# Altium project IRNAS_MPPT LT3652.PrjPcb
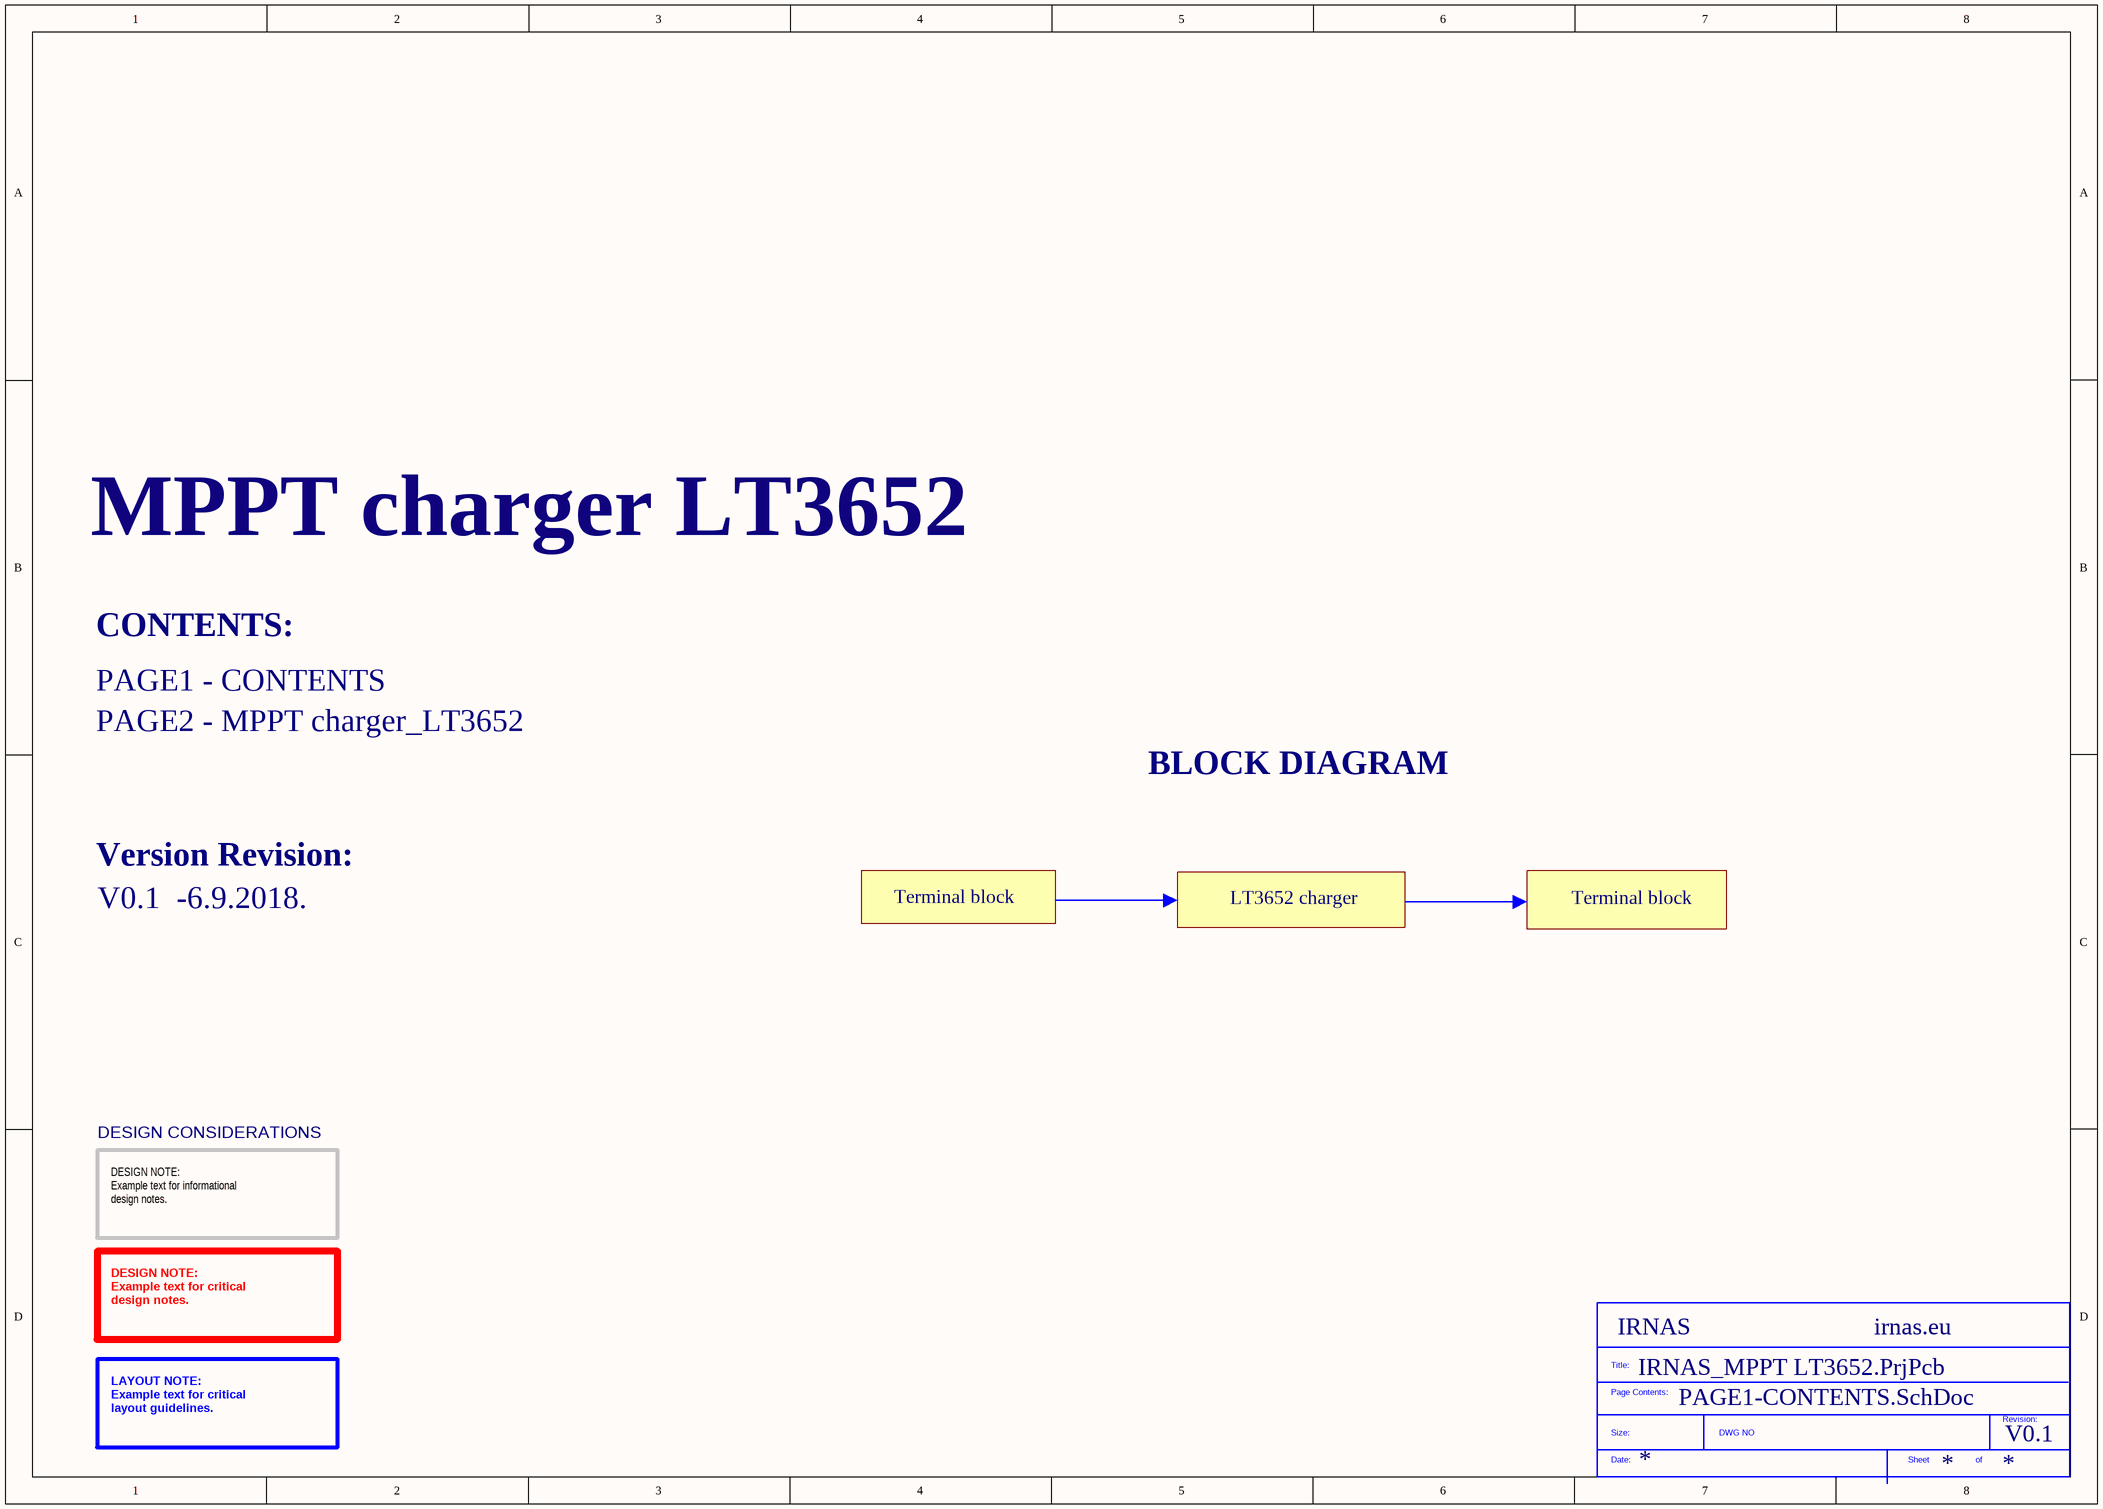
[diagram p0: PAGE1-CONTENTS.SchDoc]
Company: IRNAS; ProjectTitle: MPPT charger LT3652; Version: V0.1; website: irnas.eu
2 sheets, 25 parts. Net scope: global (net labels, ports and power ports of the same name join across sheets).
Board files: MPPT charger.PcbDoc, MPPT charger panel.PcbDoc
Sheets:
  PAGE1-CONTENTS.SchDoc
  PAGE2-MPPT charger_LT3652.SchDoc

## Sheet PAGE1-CONTENTS.SchDoc
size A3

### Parts
(Parts that share a designator on the sheet are numbered #1, #2 ... from top to bottom, then left to right.)
*?#1  SDTitleBlock  (value not drawn)  (graphical)

### Notes on the sheet
- CONTENTS:
- PAGE1 - CONTENTS
- PAGE2 - MPPT charger_LT3652
- BLOCK DIAGRAM
- Version Revision:
- V0.1  -6.9.2018.
- Terminal block
- LT3652 charger
- DESIGN CONSIDERATIONS
- DESIGN NOTE:
  Example text for informational
  design notes.
- DESIGN NOTE:
  Example text for critical
  design notes.
- LAYOUT NOTE:
  Example text for critical
  layout guidelines.
- (in symbol SDTitleBlock) Title:; Page Contents:; Revision:; Size:; DWG NO; Date:; Sheet; of

## Sheet PAGE2-MPPT charger_LT3652.SchDoc
size A3
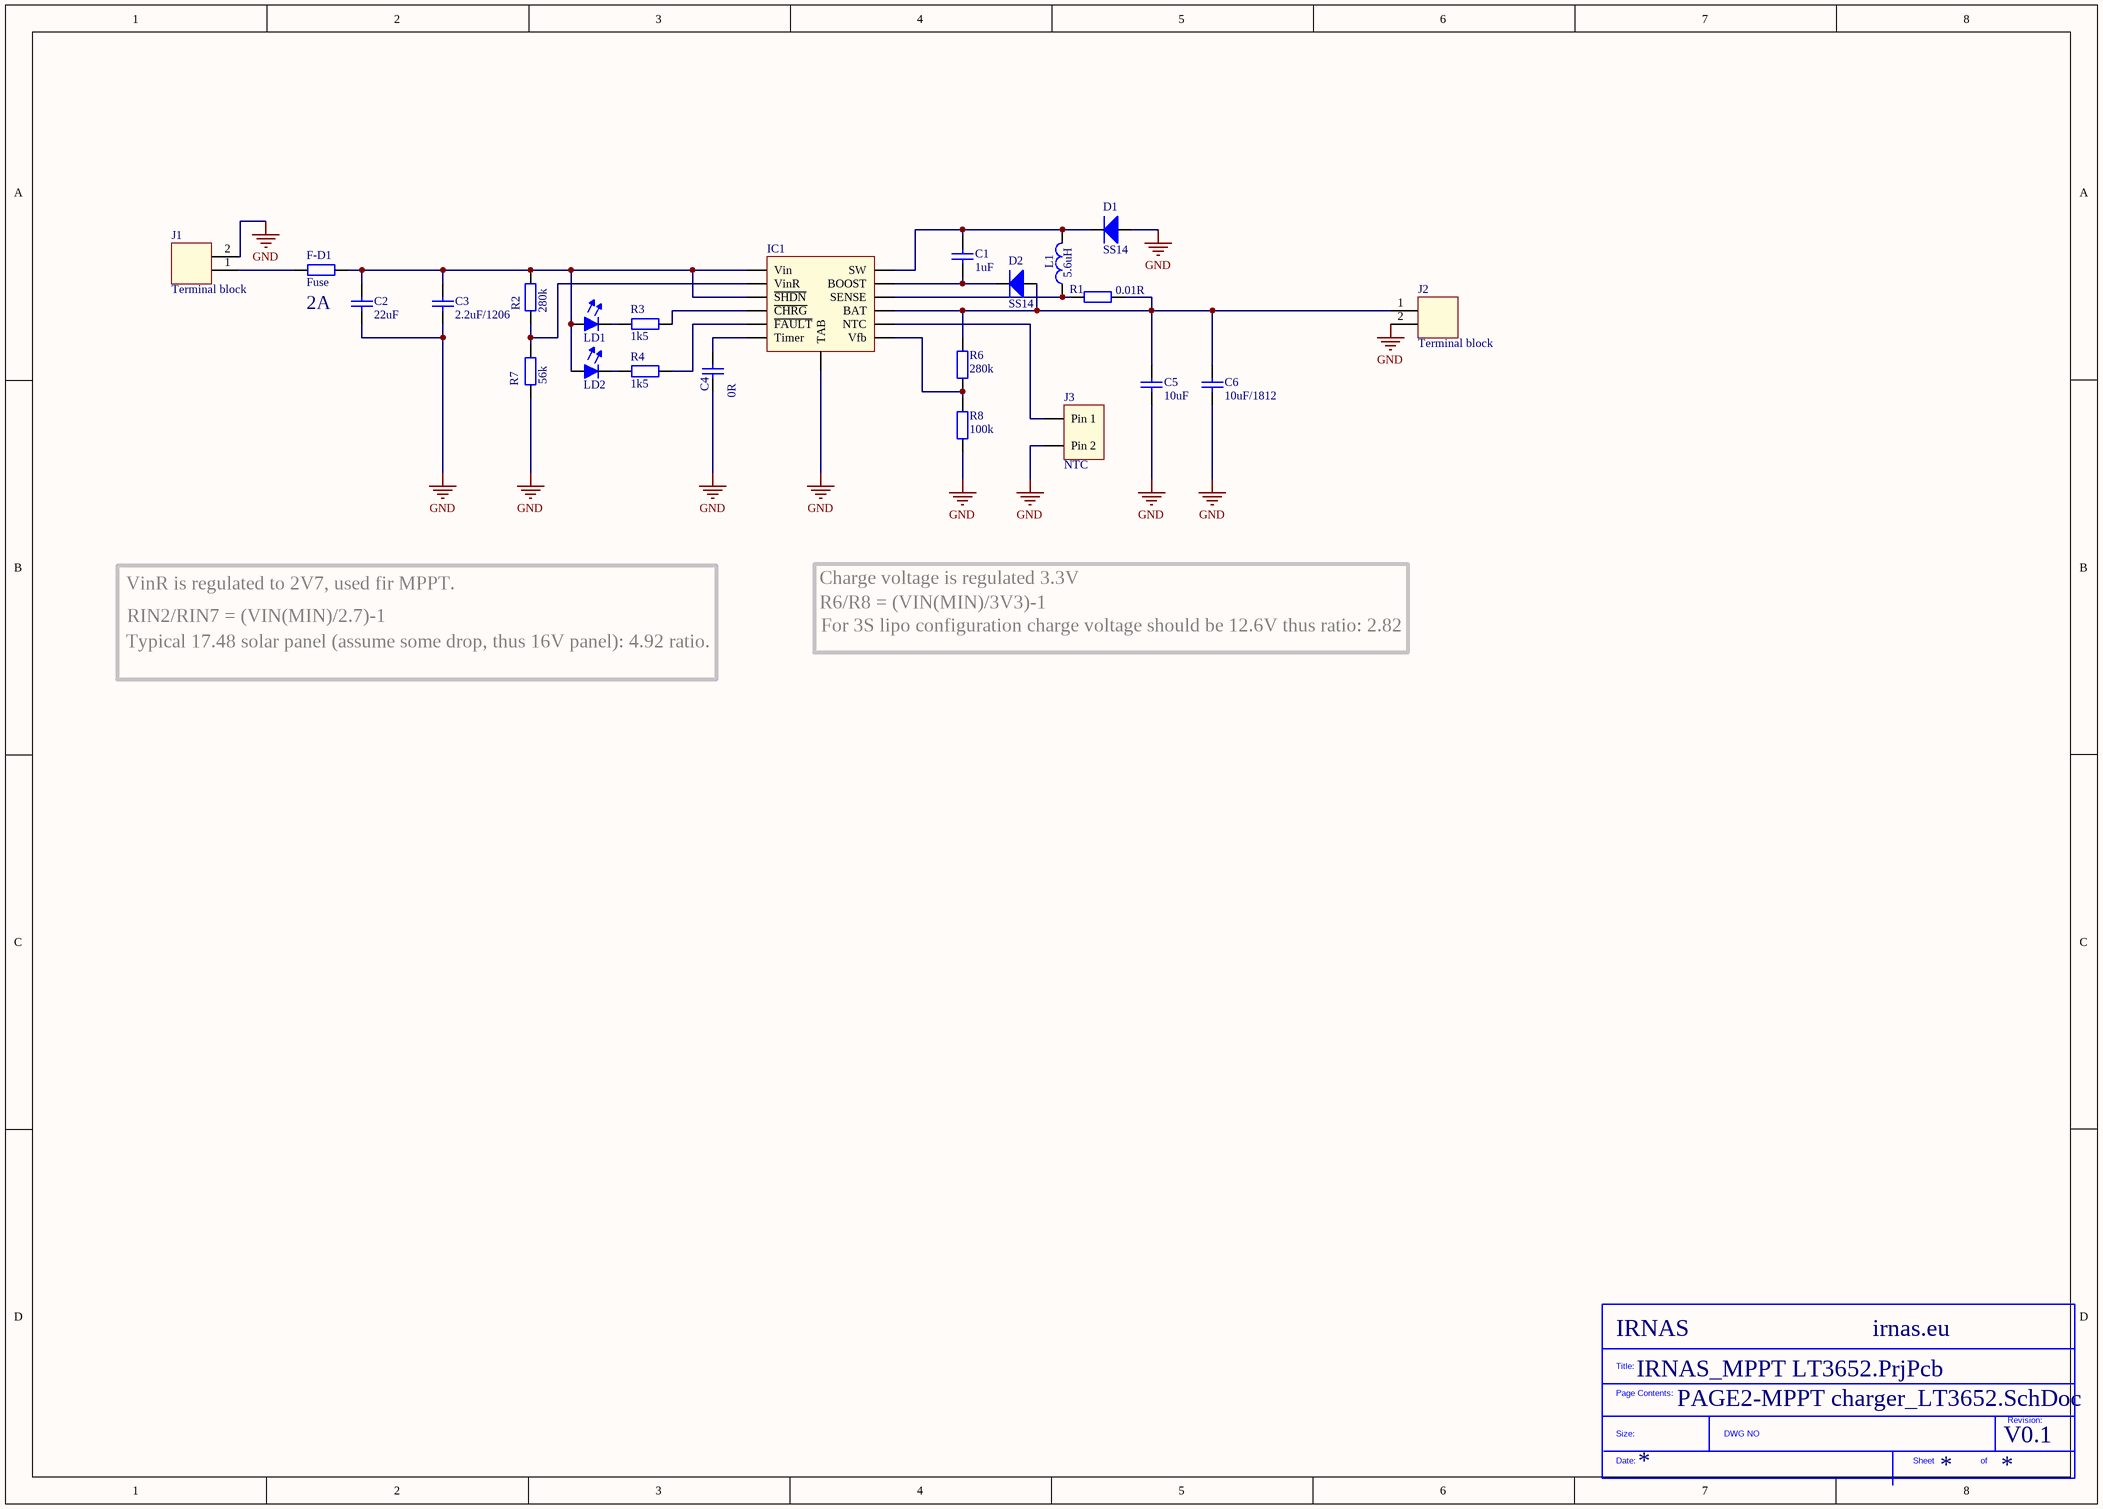
[diagram p1: PAGE2-MPPT charger_LT3652.SchDoc]

### Parts
(Parts that share a designator on the sheet are numbered #1, #2 ... from top to bottom, then left to right.)
*?#2  SDTitleBlock  (value not drawn)  (graphical)
C1  1uF  [0805 CAP]
C2  22uF  [2512 CAP]
C3  2.2uF/1206  [1206 CAP]
C4  value 0R  [0603 cap]  (hidden comment: Capacitor/Bridge)
C5  10uF  [0805 CAP]
C6  10uF/1812  [1812 CAP]
D1  SS14  [SMB]
D2  SS14  [SMB]
F-D1  Fuse  [1206 RES]
IC1  LTC3652  [MSOP12 - EP]  (value not drawn)
J1  Terminal block  [Terminal block - 2 ways]
J2  Terminal block  [Terminal block - 2 ways]
J3  NTC  [HDR1X2]
L1  5.6uH  [FDSD0420-H]
LD1  LED diode  [LED_0603]  (value not drawn)
LD2  LED diode  [LED_0603]  (value not drawn)
R1  0.01R  [1812 RES]
R2  280k  [0603 RES]
R3  value 1k5  [0603 RES]  (hidden comment: Resistor generic)
R4  value 1k5  [0603 RES]  (hidden comment: Resistor generic)
R6  280k  [0603 RES]
R7  56k  [0603 RES]
R8  100k  [0603 RES]

### Nets
GND: C2.1 C3.1 C4.1 C5.1 C6.1 D1.1(A) IC1.13(TAB) J1.2 J2.2 J3.2(Pin_2) R7.2 R8.1
NetC1_1: C1.1 D2.2(K) IC1.11(BOOST)
NetC1_2: C1.2 D1.2(K) IC1.12(SW) L1.2
NetC2_2: C2.2 C3.2 F-D1.2 IC1.1(Vin) IC1.3(~{SHDN}) LD1.1(A1) LD2.1(A1) R2.2
NetC4_2: C4.2 IC1.6(Timer)
NetC5_2: C5.2 C6.2 D2.1(A) IC1.9(BAT) J2.1 R1.1 R6.2
NetF-D1_1: F-D1.1 J1.1
NetIC1_2: IC1.2(VinR) R2.1 R7.1
NetIC1_4: IC1.4(~{CHRG}) R3.2
NetIC1_5: IC1.5(~{FAULT}) R4.2
NetIC1_7: IC1.7(Vfb) R6.1 R8.2
NetIC1_8: IC1.8(NTC) J3.1(Pin_1)
NetIC1_10: IC1.10(SENSE) L1.1 R1.2
NetLD1_2: LD1.2(K) R3.1
NetLD2_2: LD2.2(K) R4.1

### Notes on the sheet
- 2A
- Charge voltage is regulated 3.3V
- VinR is regulated to 2V7, used fir MPPT.
- Typical 17.48 solar panel (assume some drop, thus 16V panel): 4.92 ratio.
- RIN2/RIN7 = (VIN(MIN)/2.7)-1
- R6/R8 = (VIN(MIN)/3V3)-1
- For 3S lipo configuration charge voltage should be 12.6V thus ratio: 2.82
- (in symbol SDTitleBlock) Title:; Page Contents:; Revision:; Size:; DWG NO; Date:; Sheet; of

### Library data of the parts
C1 = 1uF/0805: Manufacturer: Murata; Manufacturer Part Number: GCM21BR7YA105KA55L; Capacitance: 1 µF; Dielectric: X7R; Tolerance (%): ±10 %; Rated Voltage: 35 V; Supplier 1: Farnell; Stock 1: 3630; Pricing 1: 5=0.391, 50=0.21, 250=0.162, 500=0.111 (EUR); Case Size/Dimension: 0805; ComponentLink1URL: https://datasheet.ciiva.com/11616/product-11616620.pdf; ComponentLink1Description: https://datasheet.ciiva.com/11616/product-11616620.pdf; ComponentLink2URL: https://datasheet.ciiva.com/138/s0717e-138752.pdf; ComponentLink2Description: https://datasheet.ciiva.com/138/s0717e-138752.pdf; ComponentLink3URL: https://datasheet.ciiva.com/138/s0717e-138753.pdf; ComponentLink3Description: https://datasheet.ciiva.com/138/s0717e-138753.pdf; ComponentLink4URL: https://datasheet.ciiva.com/18183/getdatasheetpartid-251151-18183719.pdf; ComponentLink4Description: https://datasheet.ciiva.com/18183/getdatasheetpartid-251151-18183719.pdf; ComponentLink5URL: https://datasheet.ciiva.com/138/s0717e-138751.pdf; ComponentLink5Description: https://datasheet.ciiva.com/138/s0717e-138751.pdf; Supplier Part Number 1: 2494199
C2 = 22uF/2512: Manufacturer: KEMET; Manufacturer Part Number: T491D226K035AT; Capacitance: 22000000 pF; Case Style: Molded; DCL: 7.7 uA; DF: 6%; ESR: 0.7 ohm; Insulation: Not Required; Lead Spacing (nom): Not Required mm; Polarity: Polar; Product Depth (mm): 4.3 mm; Product Height (mm): 2.8 mm; Product Length (mm): 7.3 mm; Rad Hardened: No; Tolerance (+ or -): 10%; Voltage: 35VDC; Supplier 1: Farnell; Stock 1: 0; Case Code: D; Construction: SMT Chip; Failure Rate: Not Required; Length W/Weld: Not Required mm; Length W/Weld (max): Not Required mm; Mounting Style: Surface Mount; Operating Temp Range: -55C to 125C; Package / Case: 7343-31; Packaging: Tape and Reel; Product Diameter (mm): Not Required mm; Seal: Not Required; Seated Plane Height: Not Required mm; Wire Form: Not Required; ComponentLink1URL: https://datasheet.ciiva.com/18095/getdatasheetpartid-114912-18095782.pdf; ComponentLink1Description: https://datasheet.ciiva.com/18095/getdatasheetpartid-114912-18095782.pdf; ComponentLink2URL: https://datasheet.ciiva.com/12882/kem-t2005-t491-12882636.pdf; ComponentLink2Description: https://datasheet.ciiva.com/12882/kem-t2005-t491-12882636.pdf; ComponentLink3URL: https://datasheet.ciiva.com/22698/1854511-22698957.pdf; ComponentLink3Description: https://datasheet.ciiva.com/22698/1854511-22698957.pdf; Supplier Part Number 1: 1457504
C3 = 2.2uF/1206: Manufacturer: Vishay Sprague; Manufacturer Part Number: TMCMA1V225MTRF; Mfr Case Code: A Case; Capacitance: 2.2 uF; Voltage Rating: 35 V; Tolerance: 20 %; ESR: 4.4 Ohms; Brand: Vishay / Sprague; Dissipation Factor DF: 8; Leakage Current: 800 nA; Ripple Current: 133 mA; Type: Solid Tantalum Surface Mount Chip Capacitors, Molded Case, Extended Range; Unit Weight: 0.000571 oz; Supplier 1: Farnell; Stock 1: 209; Pricing 1: 5=0.274, 50=0.228, 250=0.166, 500=0.153, 1000=0.14, 2000=0.122, 10000=0.119 (EUR); Product Category: Tantalum Capacitors - Solid SMD; RoHS: True; Case Code - in: 1206; Case Code - mm: 3216; Height: 1.8 mm; Operating Temperature Range: - 55 C to + 125 C; Series: TMCM; Length: 3.2 mm; Maximum Operating Temperature: + 125 C; Minimum Operating Temperature: - 55 C; Package / Case: 1206 (3216 metric); Packaging: Reel; Product: Tantalum Solid Surface Mounts; Factory Pack Quantity: 2000; Termination Style: SMD/SMT; Width: 1.6 mm; ComponentLink1URL: http://www.mouser.com/ds/2/427/tmcm-515668.pdf; ComponentLink1Description: http://www.mouser.com/ds/2/427/tmcm-515668.pdf; ComponentLink2URL: http://www.farnell.com/datasheets/1948250.pdf; ComponentLink2Description: http://www.farnell.com/datasheets/1948250.pdf; ComponentLink3URL: http://www.vishay.com/docs/40178/tmcm.pdf; ComponentLink3Description: http://www.vishay.com/docs/40178/tmcm.pdf; Supplier Part Number 1: 2491481
C4 = Capacitor NP: Desc: Cap or Res 0R; Voltage: *
C5 = 10uF/0805: Manufacturer: Murata; Manufacturer Part Number: GRM219R61A106KE44D; Product Training Modules: High-Cap Multilayer Ceramic Capacitors; Catalog Drawings: GRM Series_0805_0.85; Featured Product: GA3 Safety Recognized Caps and Hi-Cap MLCC; Capacitance: 10µF; Tolerance: ±10%; Voltage - Rated: 10V; Temperature Coefficient: X5R; Online Catalog: GRM Series; Other Names: 490-4735-1; Supplier 1: Farnell; Stock 1: 1196; Pricing 1: 10=0.252, 100=0.139, 500=0.102, 1000=0.0939 (EUR); Standard Package: 1; Category: Capacitors; Family: Ceramic Capacitors; Series: GRM; Packaging: Cut Tape (CT); Mounting Type: Surface Mount, MLCC; Operating Temperature: -55°C ~ 85°C; Applications: General Purpose; Ratings: -; Package / Case: 0805 (2012 Metric); Size / Dimension: 0.079" L x 0.049" W (2.00mm x 1.25mm); Height - Seated (Max): -; Thickness (Max): 0.037" (0.95mm); Lead Spacing: -; Features: -; Lead Style: -; ComponentLink1URL: https://datasheet.ciiva.com/5414/product-5414357.pdf; ComponentLink1Description: https://datasheet.ciiva.com/5414/product-5414357.pdf; ComponentLink2URL: https://datasheet.ciiva.com/3777/54grm219r61a106ke4423-3777910.pdf; ComponentLink2Description: https://datasheet.ciiva.com/3777/54grm219r61a106ke4423-3777910.pdf; ComponentLink3URL: https://datasheet.ciiva.com/172/grm219r61a106ke44-01-172352.pdf; ComponentLink3Description: https://datasheet.ciiva.com/172/grm219r61a106ke44-01-172352.pdf; ComponentLink4URL: https://datasheet.ciiva.com/172/grm219r61a106ke44-01-172353.pdf; ComponentLink4Description: https://datasheet.ciiva.com/172/grm219r61a106ke44-01-172353.pdf; ComponentLink5URL: https://datasheet.ciiva.com/172/grm219r61a106ke44-01-172354.pdf; ComponentLink5Description: https://datasheet.ciiva.com/172/grm219r61a106ke44-01-172354.pdf; ComponentLink6URL: https://datasheet.ciiva.com/7719/c02e-7719062.pdf; ComponentLink6Description: https://datasheet.ciiva.com/7719/c02e-7719062.pdf; ComponentLink7URL: https://datasheet.ciiva.com/2989/product-2989663.pdf; ComponentLink7Description: https://datasheet.ciiva.com/2989/product-2989663.pdf; ComponentLink8URL: https://datasheet.ciiva.com/17451/product-17451791.pdf; ComponentLink8Description: https://datasheet.ciiva.com/17451/product-17451791.pdf; Supplier Part Number 1: 1845741
C6 = 10uF/1812: Manufacturer: KEMET; Manufacturer Part Number: C1812C106K3RACTU; Part # Aliases: C1812C106K3RAC7800; Capacitance: 10 uF; Voltage Rating DC: 25 VDC; Dielectric: X7R; Tolerance: 10 %; Case Length: 4.5 mm; Case Width: 3.2 mm; Class: Class 2; Type: SMD MLCC X7R 6.3 - 250 VDC Commerical Grade; Supplier 1: Farnell; Stock 1: 1665; Pricing 1: 1=3.18, 50=1.5, 100=1.25, 250=1.07 (EUR); Product Category: Multilayer Ceramic Capacitors MLCC - SMD/SMT; RoHS: Details; Brand: Kemet; Case Code - in: 1812; Case Code - mm: 4532; Minimum Operating Temperature: - 55 C; Maximum Operating Temperature: + 125 C; Termination Style: SMD/SMT; Product: General Type MLCCs; Package / Case: 1812 (4532 metric); Packaging: Reel; Series: C1812C; Factory Pack Quantity: 1000; ComponentLink1URL: https://datasheet.ciiva.com/7807/kem-c1002-x7r-smd-7807557.pdf; ComponentLink1Description: https://datasheet.ciiva.com/7807/kem-c1002-x7r-smd-7807557.pdf; ComponentLink2URL: https://datasheet.ciiva.com/7807/1698758-7807342.pdf; ComponentLink2Description: https://datasheet.ciiva.com/7807/1698758-7807342.pdf; ComponentLink3URL: https://datasheet.ciiva.com/7807/1698758-7807343.pdf; ComponentLink3Description: https://datasheet.ciiva.com/7807/1698758-7807343.pdf; Supplier Part Number 1: 1358500
D1 D2 = Diode 1N4148: High Conductance Fast Diode; Manufacturer: ON Semiconductor / Fairchild; Manufacturer Part Number: SS14FL; Diode Type: Schottky; Voltage - DC Reverse (Vr) (Max): 40V; Current - Average Rectified (Io): 1A; Voltage - Forward (Vf) (Max) @ If: 550mV @ 1A; Speed: Fast Recovery =  200mA (Io); Reverse Recovery Time (trr): 5.695ns; Current - Reverse Leakage @ Vr: 30µA @ 40V; Supplier 1: Farnell; Stock 1: 2350; Pricing 1: 5=0.221, 25=0.214, 100=0.0895, 250=0.0825, 500=0.0654, 1000=0.0483, 5000=0.0404 (EUR); Category: Discrete Semiconductor Products; Family: Diodes - Rectifiers - Single; Series: Automotive, AEC-Q101; Packaging: Tape & Reel (TR); Capacitance @ Vr, F: -; Mounting Type: Surface Mount; Package / Case: SOD-123F; Supplier Device Package: SOD-123F; Operating Temperature - Junction: -55°C ~ 125°C; ComponentLink1URL: https://www.fairchildsemi.com/datasheets/SS/SS13FL.pdf; ComponentLink1Description: https://www.fairchildsemi.com/datasheets/SS/SS13FL.pdf; Supplier Part Number 1: 2822564
F-D1 = F-D1: Manufacturer: Littelfuse; Manufacturer Part Number: 0466002,NR; Current Rating: 2 A; Voltage Rating: 63 V ac/dc; Fuse Speed: FF; Body Material: Advanced High Temperature Substrate; Breaking Capacity at Maximum Voltage Rating: 50 A @ 63 V ac/dc; Supplier 1: Farnell; Stock 1: 8073; Pricing 1: 10=0.591, 100=0.399, 500=0.364, 1000=0.357, 2500=0.349, 5000=0.348, 25000=0.347 (EUR); Length: 3.175mm; Width: 1.524mm; Height: 0.585mm; Dimensions: 3.175 x 1.524 x 0.585mm; Minimum Operating Temperature: -55°C; Maximum Operating Temperature: +90°C; Terminal Material: Tin Over Nickel Over Copper; Operating Temperature Range: -55 → +90 °C; ComponentLink1URL: http://uk.rs-online.com/webdocs/0785/0900766b80785544.pdf; ComponentLink1Description: http://uk.rs-online.com/webdocs/0785/0900766b80785544.pdf; Supplier Part Number 1: 9921877
J1 J2 = Terminal block - 2ways: CONN TERM BLOCK 2POS 5MM PCB; Manufacturer: Phoenix Contact; Manufacturer Part Number: 1715022; Part # Aliases: MKDS_1,5/_2 MKDS152; Number of Positions: 2 Position; Connection Method: Screw; Current Rating: 17.5 A; Voltage Rating: 400 V; Wire Gauge Range: 26 AWG to 10 AWG; Wire Gauge Max: 10 AWG; Wire Gauge Min: 26 AWG; Unit Weight: 0.094181 oz; Supplier 1: Farnell; Stock 1: 2416; Pricing 1: 1=1, 50=0.958, 100=0.932, 250=0.869, 500=0.8, 1000=0.704 (EUR); Product Category: Fixed Terminal Blocks; RoHS: True; Pitch: 5 mm; Series: MKDS; Packaging: Bulk; Brand: Phoenix Contact; Flammability Rating: UL 94 V-0; Length: 9.8 mm; Product: Fixed Terminal Blocks; Factory Pack Quantity: 250; Termination Style: Through Hole; Tradename: COMBICON Control; ComponentLink1URL: https://datasheet.ciiva.com/824/1715022-824279.pdf; ComponentLink1Description: https://datasheet.ciiva.com/824/1715022-824279.pdf; ComponentLink2URL: https://datasheet.ciiva.com/15169/getdatasheetpartid-177834-15169625.pdf; ComponentLink2Description: https://datasheet.ciiva.com/15169/getdatasheetpartid-177834-15169625.pdf; ComponentLink3URL: https://datasheet.ciiva.com/16071/1715022-16071966.pdf; ComponentLink3Description: https://datasheet.ciiva.com/16071/1715022-16071966.pdf; ComponentLink4URL: https://datasheet.ciiva.com/14608/70054386-14608122.pdf; ComponentLink4Description: https://datasheet.ciiva.com/14608/70054386-14608122.pdf; Supplier Part Number 1: 3714240
J3 = Pin Header 2: Beta: 3380; Value: 10k
L1 = Inductor: Single coil; Manufacturer: Murata; Manufacturer Part Number: FDSD0420-H-1R5M=P3; Type: Wirewound; Material - Core: Powdered Iron; Inductance: 1.5µH; Tolerance: ±20%; Current Rating: 4.3A; Current - Saturation: 5.7A; Shielding: Shielded; DC Resistance (DCR): 36 mOhm Max; Frequency - Test: 100kHz; Supplier 1: Farnell; Stock 1: 1920; Pricing 1: 5=0.926, 50=0.488, 250=0.464, 500=0.408, 1000=0.331, 2000=0.3, 10000=0.293 (EUR); Category: Inductors, Coils, Chokes; Family: Fixed Inductors; Series: FDSD0420; Packaging: Tape & Reel (TR); Q @ Freq: -; Frequency - Self Resonant: -; Ratings: -; Operating Temperature: -; Mounting Type: Surface Mount; Package / Case: Nonstandard; Size / Dimension: 0.165" L x 0.165" W (4.20mm x 4.20mm); Height - Seated (Max): 0.078" (2.00mm); ComponentLink1URL: http://www.murata.com/~/media/webrenewal/products/inductor/chip/tokoproducts/wirewoundmetalalloytype/m_fdsd0420.ashx; ComponentLink1Description: http://www.murata.com/~/media/webrenewal/products/inductor/chip/tokoproducts/wirewoundmetalalloytype/m_fdsd0420.ashx; ComponentLink2URL: http://www.toko.co.jp/products/pdf/inductors/fdsd0412_fdsd0415_fdsd0420.pdf; ComponentLink2Description: http://www.toko.co.jp/products/pdf/inductors/fdsd0412_fdsd0415_fdsd0420.pdf; ComponentLink3URL: http://www.farnell.com/datasheets/2550152.pdf; ComponentLink3Description: http://www.farnell.com/datasheets/2550152.pdf; Supplier Part Number 1: 2530091
LD1 LD2 = LED diode: LED; Manufacturer: Multicomp; Manufacturer Part Number: 703-0112; LED Colour: Red; LED Mounting: SMD; Forward Current If: 20mA; Forward Voltage: 1.8V; Wavelength Typ: 643nm; Luminous Intensity: 15mcd; Viewing Angle: 140°; Lens Shape: Rectangular; Supplier 1: Farnell; Stock 1: 627; Pricing 1: 5=0.163, 25=0.139, 100=0.108, 250=0.0887, 500=0.0813, 1000=0.075 (EUR); Bulb Size: -; Packaging: Each; Product Range: -; Automotive Qualification Standard: -; ComponentLink1URL: https://datasheet.ciiva.com/1244/1758066-1244070.pdf; ComponentLink1Description: https://datasheet.ciiva.com/1244/1758066-1244070.pdf; ComponentLink2URL: https://datasheet.ciiva.com/23621/1626779-23621468.pdf; ComponentLink2Description: https://datasheet.ciiva.com/23621/1626779-23621468.pdf; Supplier Part Number 1: 2112124
R1 = 0.01R: Manufacturer: Vishay; Manufacturer Part Number: WSLT2010R0100FEA18; Resistance: 0.01ohm; Resistor Case Style: 2010 [5025 Metric]; Power Rating: 1W; Resistance Tolerance: ± 1%; Product Range: WSLT2010 Series; Resistor Element Type: Metal Strip; Temperature Coefficient: ± 75ppm/°C; Automotive Qualification Standard: AEC-Q200; SVHC: To Be Advised; Supplier 1: Farnell; Stock 1: 12782; Pricing 1: 10=0.985, 100=0.708, 500=0.572, 1000=0.522 (EUR); Packaging: Cut Tape; MSL: MSL 1 - Unlimited; ComponentLink1URL: http://www.farnell.com/datasheets/2049204.pdf; ComponentLink1Description: http://www.farnell.com/datasheets/2049204.pdf; ComponentLink2URL: http://www.mouser.com/ds/2/427/wslt2010-73010.pdf; ComponentLink2Description: http://www.mouser.com/ds/2/427/wslt2010-73010.pdf; Supplier Part Number 1: 2420772
R2 = 47K: RESISTOR, 0603, 47K, FULL REEL; Manufacturer: Panasonic; Manufacturer Part Number: ERA-3AEB473V; Rated Power: 0.1 W; Resistance: 47 kO; Tolerance (%): ±0.1 %; Temp Coefficient: ±25 ppm/°C; Supplier 1: Farnell; Stock 1: 0; Size Code: 0603; ComponentLink1URL: https://datasheet.ciiva.com/11808/0900766b80fe20f7-11808041.pdf; ComponentLink1Description: https://datasheet.ciiva.com/11808/0900766b80fe20f7-11808041.pdf; ComponentLink2URL: https://datasheet.ciiva.com/29183/451523-da-01-en-widerstand-0603-era-29183849.pdf; ComponentLink2Description: https://datasheet.ciiva.com/29183/451523-da-01-en-widerstand-0603-era-29183849.pdf; ComponentLink3URL: https://datasheet.ciiva.com/46422/485442-46422694.pdf; ComponentLink3Description: https://datasheet.ciiva.com/46422/485442-46422694.pdf; ComponentLink4URL: https://datasheet.ciiva.com/43455/485442-43455239.pdf; ComponentLink4Description: https://datasheet.ciiva.com/43455/485442-43455239.pdf; ComponentLink5URL: https://datasheet.ciiva.com/46422/485442-46422695.pdf; ComponentLink5Description: https://datasheet.ciiva.com/46422/485442-46422695.pdf; ComponentLink6URL: https://datasheet.ciiva.com/16763/70068849-16763496.pdf; ComponentLink6Description: https://datasheet.ciiva.com/16763/70068849-16763496.pdf; ComponentLink7URL: https://datasheet.ciiva.com/46422/485442-46422696.pdf; ComponentLink7Description: https://datasheet.ciiva.com/46422/485442-46422696.pdf; ComponentLink8URL: https://datasheet.ciiva.com/9189/aoa0000ce26-9189371.pdf; ComponentLink8Description: https://datasheet.ciiva.com/9189/aoa0000ce26-9189371.pdf; ComponentLink9URL: https://datasheet.ciiva.com/48530/era-eng-tds-48530428.pdf; ComponentLink9Description: https://datasheet.ciiva.com/48530/era-eng-tds-48530428.pdf; ComponentLink10URL: https://datasheet.ciiva.com/6137/485442-6137967.pdf; ComponentLink10Description: https://datasheet.ciiva.com/6137/485442-6137967.pdf; ComponentLink11URL: https://datasheet.ciiva.com/9117/aoa0000ce26-9117711.pdf; ComponentLink11Description: https://datasheet.ciiva.com/9117/aoa0000ce26-9117711.pdf; ComponentLink12URL: https://datasheet.ciiva.com/16776/70068849-16776671.pdf; ComponentLink12Description: https://datasheet.ciiva.com/16776/70068849-16776671.pdf; ComponentLink13URL: https://datasheet.ciiva.com/48425/era-eng-tds-48425471.pdf; ComponentLink13Description: https://datasheet.ciiva.com/48425/era-eng-tds-48425471.pdf; Supplier Part Number 1: 1577628
R3 R4 = 1K5: Manufacturer: Vishay; Manufacturer Part Number: CRCW08051K50FKEA; Brand: Vishay / Dale; Resistance: 1.5 kOhms; Tolerance: 1 %; Power Rating: 125 mW (1/8 W); Temperature Coefficient: 100 PPM / K; Voltage Rating: 150 V; Unit Weight: 0.000194 oz; Supplier 1: Farnell; Stock 1: 1298; Pricing 1: 10=0.0358, 100=0.0246, 500=0.0193, 1000=0.0098 (GBP); Product Category: Thick Film Resistors - SMD; RoHS: Details; Case Code - in: 0805; Case Code - mm: 2012; Operating Temperature Range: - 55 C to + 155 C; Series: CRCW; Height: 0.45 mm; Length: 2 mm; Package / Case: 0805 (2012 metric); Packaging: Reel; Product: Thick Film Resistors SMD; Factory Pack Quantity: 5000; Termination Style: SMD/SMT; Width: 1.25 mm; ComponentLink1URL: https://datasheet.ciiva.com/11809/0900766b80d98b26-11809039.pdf; ComponentLink1Description: https://datasheet.ciiva.com/11809/0900766b80d98b26-11809039.pdf; ComponentLink2URL: https://datasheet.ciiva.com/2467/dcrcwe3-2467185.pdf; ComponentLink2Description: https://datasheet.ciiva.com/2467/dcrcwe3-2467185.pdf; ComponentLink3URL: https://datasheet.ciiva.com/2467/dcrcwe3-2467186.pdf; ComponentLink3Description: https://datasheet.ciiva.com/2467/dcrcwe3-2467186.pdf; ComponentLink4URL: https://datasheet.ciiva.com/2467/dcrcwe3-2467187.pdf; ComponentLink4Description: https://datasheet.ciiva.com/2467/dcrcwe3-2467187.pdf; ComponentLink5URL: https://datasheet.ciiva.com/16291/dcrcwe3-16291272.pdf; ComponentLink5Description: https://datasheet.ciiva.com/16291/dcrcwe3-16291272.pdf; ComponentLink6URL: https://datasheet.ciiva.com/7777/1720486-7777609.pdf; ComponentLink6Description: https://datasheet.ciiva.com/7777/1720486-7777609.pdf; ComponentLink7URL: https://datasheet.ciiva.com/16778/70201119-16778857.pdf; ComponentLink7Description: https://datasheet.ciiva.com/16778/70201119-16778857.pdf; ComponentLink8URL: https://datasheet.ciiva.com/26312/fld-crcw-e3-data-en-26312926.pdf; ComponentLink8Description: https://datasheet.ciiva.com/26312/fld-crcw-e3-data-en-26312926.pdf; ComponentLink9URL: https://datasheet.ciiva.com/3258/dcrcwe3-3258255.pdf; ComponentLink9Description: https://datasheet.ciiva.com/3258/dcrcwe3-3258255.pdf; ComponentLink10URL: https://datasheet.ciiva.com/7777/1697337-7777375.pdf; ComponentLink10Description: https://datasheet.ciiva.com/7777/1697337-7777375.pdf; Supplier Part Number 1: 1652940
R6 = 100K: Manufacturer: Panasonic; Manufacturer Part Number: ERA-3AEB104V; Resistance: 100 kΩ; Rated Power: 0.1 W; Tolerance (%): ±0.1 %; Temp Coefficient: ±25 ppm/°C; Working Voltage-Nom: 75 V; Overload Voltage - Max: 150 V; No. of Terminations: 2; Supplier 1: Farnell; Stock 1: 8907; Pricing 1: 10=0.166, 100=0.0958, 500=0.077, 1000=0.0481 (GBP); Technology: Thin Film; Operating Temp Range: -55 to +155 °C; Case Size: 0603 (1608 Metric); Height - Max: 0.55 mm; ComponentLink1URL: https://datasheet.ciiva.com/11808/0900766b80fe20f7-11808030.pdf; ComponentLink1Description: https://datasheet.ciiva.com/11808/0900766b80fe20f7-11808030.pdf; ComponentLink2URL: https://datasheet.ciiva.com/29183/451655-da-01-en-widerstand-0603-era-29183868.pdf; ComponentLink2Description: https://datasheet.ciiva.com/29183/451655-da-01-en-widerstand-0603-era-29183868.pdf; ComponentLink3URL: https://datasheet.ciiva.com/5734/485442-5734533.pdf; ComponentLink3Description: https://datasheet.ciiva.com/5734/485442-5734533.pdf; ComponentLink4URL: https://datasheet.ciiva.com/16202/aoa0000ce26-16202041.pdf; ComponentLink4Description: https://datasheet.ciiva.com/16202/aoa0000ce26-16202041.pdf; ComponentLink5URL: https://datasheet.ciiva.com/46422/485442-46422521.pdf; ComponentLink5Description: https://datasheet.ciiva.com/46422/485442-46422521.pdf; ComponentLink6URL: https://datasheet.ciiva.com/9186/aoa0000ce26-9186700.pdf; ComponentLink6Description: https://datasheet.ciiva.com/9186/aoa0000ce26-9186700.pdf; ComponentLink7URL: https://datasheet.ciiva.com/30100/54aoa0000ce26-30100782.pdf; ComponentLink7Description: https://datasheet.ciiva.com/30100/54aoa0000ce26-30100782.pdf; ComponentLink8URL: https://datasheet.ciiva.com/48530/era-eng-tds-48530350.pdf; ComponentLink8Description: https://datasheet.ciiva.com/48530/era-eng-tds-48530350.pdf; ComponentLink9URL: https://datasheet.ciiva.com/16724/70068849-16724943.pdf; ComponentLink9Description: https://datasheet.ciiva.com/16724/70068849-16724943.pdf; ComponentLink10URL: https://datasheet.ciiva.com/46388/485442-46388111.pdf; ComponentLink10Description: https://datasheet.ciiva.com/46388/485442-46388111.pdf; Supplier Part Number 1: 1577632
R7 = 39K: Manufacturer: Vishay; Manufacturer Part Number: CRCW060339K0FKEA; Brand: Vishay / Dale; Resistance: 39 kOhms; Power Rating: 100 mW; Tolerance: 1 %; Temperature Coefficient: 100 PPM / K; Voltage Rating: 75 V; Case Height: 0.45 mm; Case Length: 1.55 mm; Case Width: 0.85 mm; Unit Weight: 0.000071 oz; Supplier 1: Farnell; Stock 1: 0; Product Category: Thick Film Resistors - SMD; RoHS: Details; Case Code - in: 0603; Case Code - mm: 1608; Operating Temperature Range: - 55 C to + 155 C; Package / Case: 0603 (1608 metric); Packaging: Reel; Product: Thick Film Resistors SMD; Series: CRCW; Factory Pack Quantity: 5000; ComponentLink1URL: https://datasheet.ciiva.com/11810/0900766b80d98afc-11810034.pdf; ComponentLink1Description: https://datasheet.ciiva.com/11810/0900766b80d98afc-11810034.pdf; ComponentLink2URL: https://datasheet.ciiva.com/2465/dcrcwe3-2465920.pdf; ComponentLink2Description: https://datasheet.ciiva.com/2465/dcrcwe3-2465920.pdf; ComponentLink3URL: https://datasheet.ciiva.com/7841/1697337-7841830.pdf; ComponentLink3Description: https://datasheet.ciiva.com/7841/1697337-7841830.pdf; ComponentLink4URL: https://datasheet.ciiva.com/26316/fld-crcw-e3-data-en-26316550.pdf; ComponentLink4Description: https://datasheet.ciiva.com/26316/fld-crcw-e3-data-en-26316550.pdf; ComponentLink5URL: https://datasheet.ciiva.com/16436/dcrcwe3-16436039.pdf; ComponentLink5Description: https://datasheet.ciiva.com/16436/dcrcwe3-16436039.pdf; ComponentLink6URL: https://datasheet.ciiva.com/16514/dcrcwe3-16514791.pdf; ComponentLink6Description: https://datasheet.ciiva.com/16514/dcrcwe3-16514791.pdf; ComponentLink7URL: https://datasheet.ciiva.com/16768/70201119-16768839.pdf; ComponentLink7Description: https://datasheet.ciiva.com/16768/70201119-16768839.pdf; ComponentLink8URL: https://datasheet.ciiva.com/7841/1697337-7841593.pdf; ComponentLink8Description: https://datasheet.ciiva.com/7841/1697337-7841593.pdf; ComponentLink9URL: https://datasheet.ciiva.com/2465/dcrcwe3-2465918.pdf; ComponentLink9Description: https://datasheet.ciiva.com/2465/dcrcwe3-2465918.pdf; ComponentLink10URL: https://datasheet.ciiva.com/3257/dcrcwe3-3257518.pdf; ComponentLink10Description: https://datasheet.ciiva.com/3257/dcrcwe3-3257518.pdf; ComponentLink11URL: https://datasheet.ciiva.com/2465/dcrcwe3-2465919.pdf; ComponentLink11Description: https://datasheet.ciiva.com/2465/dcrcwe3-2465919.pdf; ComponentLink12URL: https://datasheet.ciiva.com/3257/dcrcwe3-3257519.pdf; ComponentLink12Description: https://datasheet.ciiva.com/3257/dcrcwe3-3257519.pdf; ComponentLink13URL: https://datasheet.ciiva.com/5551/dcrcwe3-109170-5551951.pdf; ComponentLink13Description: https://datasheet.ciiva.com/5551/dcrcwe3-109170-5551951.pdf; Supplier Part Number 1: 1469804
R8 = 300K: Manufacturer: Panasonic; Manufacturer Part Number: ERA-3AEB304V; Rated Power: 0.1 W; Resistance: 300 kO; Tolerance (%): ±0.1 %; Temp Coefficient: ±25 ppm/°C; Supplier 1: Farnell; Stock 1: 13349; Pricing 1: 10=0.209, 100=0.124, 500=0.0974, 1000=0.0606 (EUR); Size Code: 0603; ComponentLink1URL: https://datasheet.ciiva.com/29183/451825-da-01-en-widerstand-0603-era-29183898.pdf; ComponentLink1Description: https://datasheet.ciiva.com/29183/451825-da-01-en-widerstand-0603-era-29183898.pdf; ComponentLink2URL: https://datasheet.ciiva.com/5998/485442-5998805.pdf; ComponentLink2Description: https://datasheet.ciiva.com/5998/485442-5998805.pdf; ComponentLink3URL: https://datasheet.ciiva.com/9183/aoa0000ce26-9183317.pdf; ComponentLink3Description: https://datasheet.ciiva.com/9183/aoa0000ce26-9183317.pdf; ComponentLink4URL: https://datasheet.ciiva.com/22739/485442-22739477.pdf; ComponentLink4Description: https://datasheet.ciiva.com/22739/485442-22739477.pdf; ComponentLink5URL: https://datasheet.ciiva.com/48530/era-eng-tds-48530389.pdf; ComponentLink5Description: https://datasheet.ciiva.com/48530/era-eng-tds-48530389.pdf; ComponentLink6URL: https://datasheet.ciiva.com/5998/485442-5998807.pdf; ComponentLink6Description: https://datasheet.ciiva.com/5998/485442-5998807.pdf; ComponentLink7URL: https://datasheet.ciiva.com/25652/aoa0000ce26-25652696.pdf; ComponentLink7Description: https://datasheet.ciiva.com/25652/aoa0000ce26-25652696.pdf; ComponentLink8URL: https://datasheet.ciiva.com/16760/70068849-16760202.pdf; ComponentLink8Description: https://datasheet.ciiva.com/16760/70068849-16760202.pdf; ComponentLink9URL: https://datasheet.ciiva.com/46422/485442-46422650.pdf; ComponentLink9Description: https://datasheet.ciiva.com/46422/485442-46422650.pdf; ComponentLink10URL: https://datasheet.ciiva.com/46422/485442-46422651.pdf; ComponentLink10Description: https://datasheet.ciiva.com/46422/485442-46422651.pdf; ComponentLink11URL: https://datasheet.ciiva.com/46422/485442-46422652.pdf; ComponentLink11Description: https://datasheet.ciiva.com/46422/485442-46422652.pdf; ComponentLink12URL: https://datasheet.ciiva.com/48425/era-eng-tds-48425454.pdf; ComponentLink12Description: https://datasheet.ciiva.com/48425/era-eng-tds-48425454.pdf; ComponentLink13URL: https://datasheet.ciiva.com/30135/54aoa0000ce26-30135311.pdf; ComponentLink13Description: https://datasheet.ciiva.com/30135/54aoa0000ce26-30135311.pdf; ComponentLink14URL: https://datasheet.ciiva.com/43455/485442-43455391.pdf; ComponentLink14Description: https://datasheet.ciiva.com/43455/485442-43455391.pdf; Supplier Part Number 1: 1670209
IC1 = LTC3652: Value: LTC3652